# EAGLE board EEZ PSU consolidated r5B8 (EAGLE 6.1), part 1 of 4
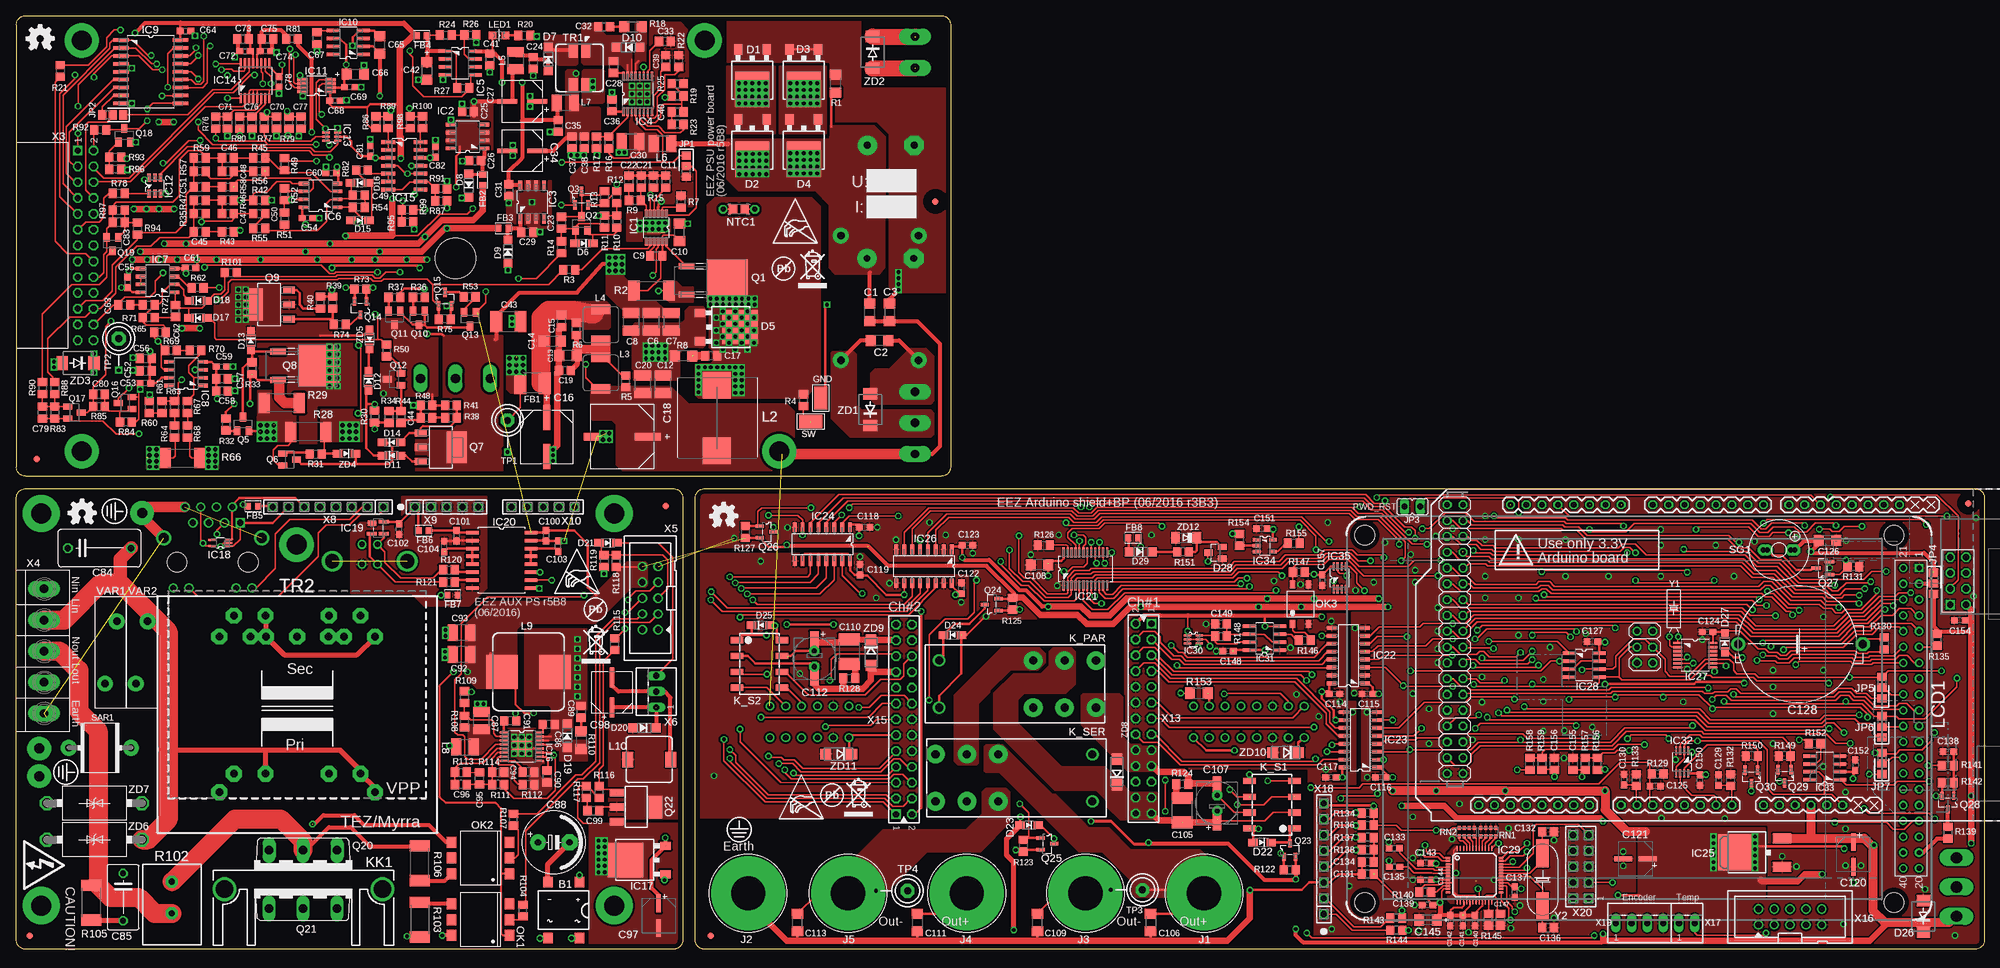
[diagram p12: board, top side]
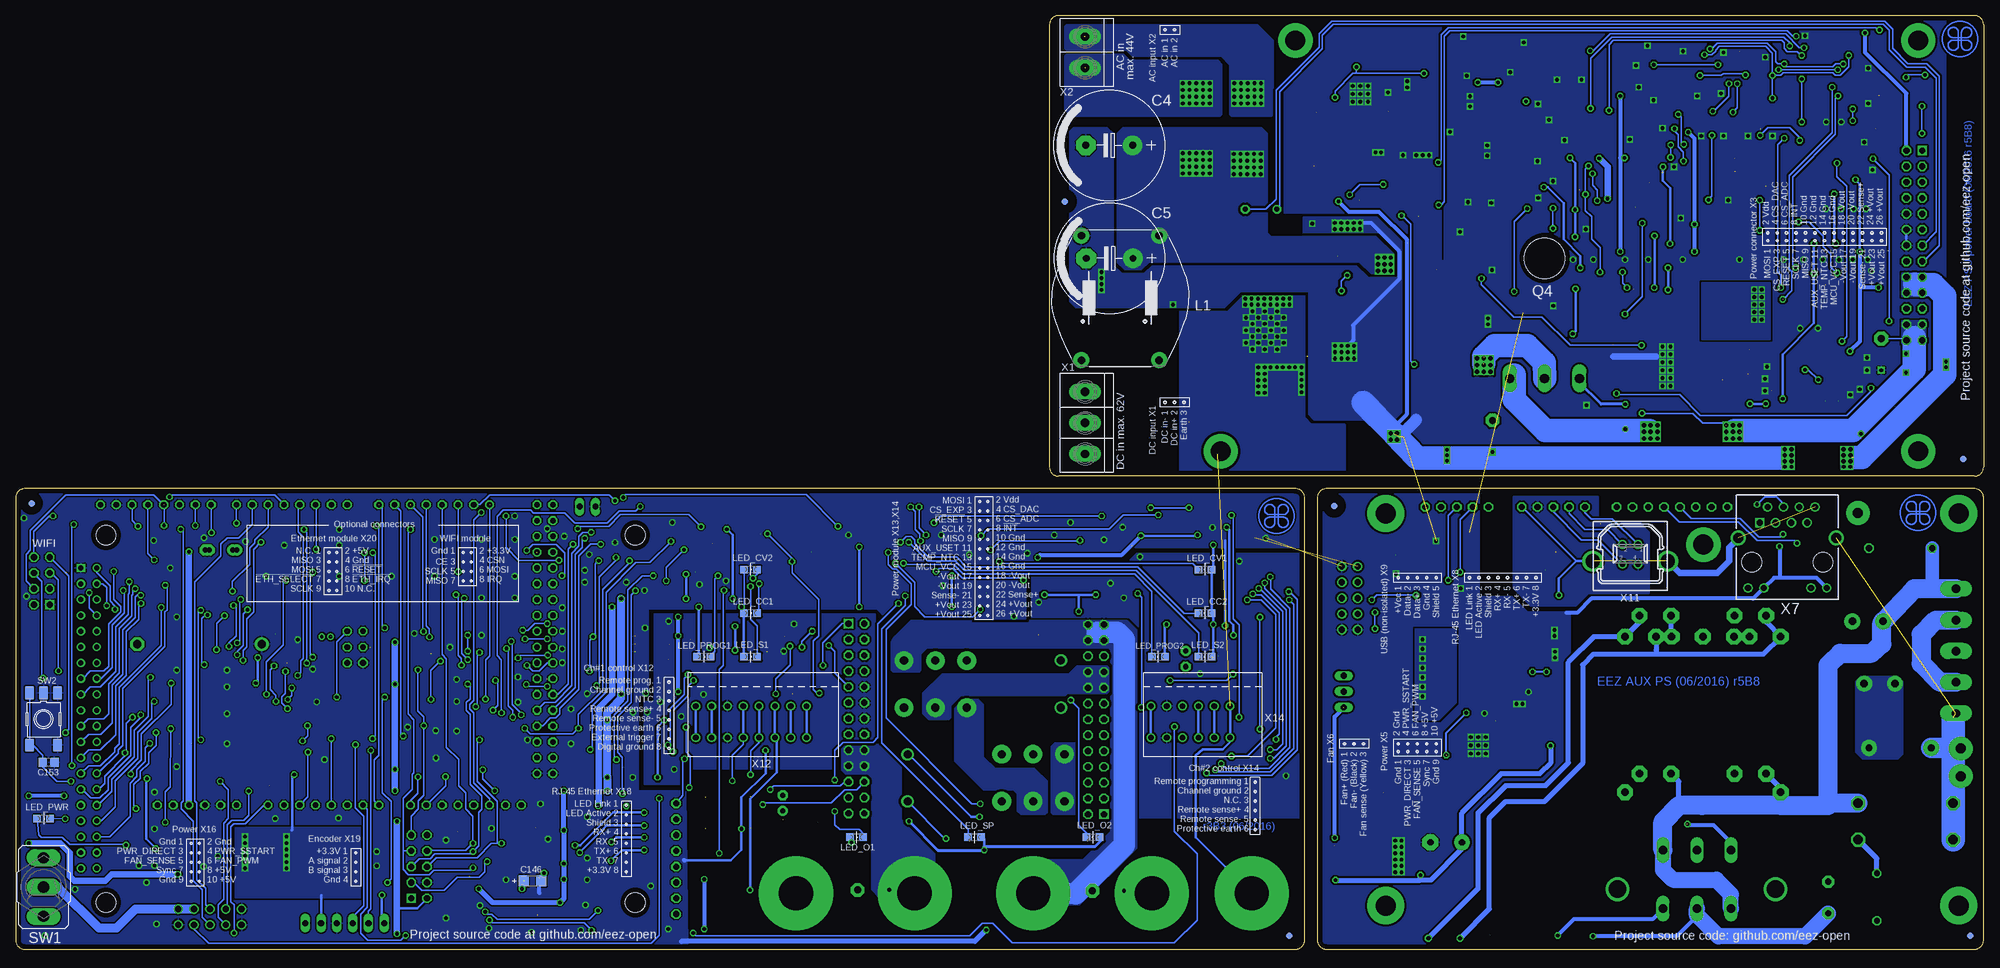
[diagram p13: board, bottom side, seen from below]

Size 316 x 150 mm. Coordinates in mm from the lower left corner, seen from the top.
Outline: 1.5,76 148.5,76 arc90 150,77.5 150,148.5 arc90 148.5,150 1.5,150 arc90 0,148.5 0,77.5 arc90 1.5,76
Outline: 1.5,74 105.5,74 arc-90 107,72.5 107,1.5 arc-90 105.5,0 1.5,0 arc-90 0,1.5 0,72.5 arc-90 1.5,74
Outline: 110.5,74 314.5,74 arc-90 316,72.5 316,1.5 arc-90 314.5,0 110.5,0 arc-90 109,1.5 109,72.5 arc-90 110.5,74
Copper layers (1+5*16): Top 0.035mm / dielectric 0.75mm / Route5 0.035mm / dielectric 0.75mm / Bottom 0.035mm
Design rules: minimum track width 10mil, minimum drill 0.5mm, track to track 8mil, track to pad 8mil, pad to pad 8mil, via to via 8mil, smd to smd 8mil, copper to edge 30mil, drill to drill 8mil, minimum pad ring 10mil, minimum via ring 8mil, stop-mask expansion 4mil, vias tented up to drill 25mil, thermal gap 10mil
Net classes: 0 default: width 0.254 mm, drill 0.584 mm, clearance 0.254 mm; 1 dgnd: width 0.254 mm, drill 0.584 mm, clearance 0.254 mm; 2 gnd: width 0.254 mm, drill 0.584 mm, clearance 0.254 mm

## Footprints (pad centres in the part's own frame; a part is rotated, then mirrored left to right if it is on the bottom)
DFS = smd 1.5 x 1.7: + -2.55,-4.5; - 2.55,-4.5; AC1 -2.55,4.5; AC2 2.55,4.5
C1206 = smd 1.6 x 1.8: 1 -1.4,0; 2 1.4,0
ECAP7.5/18 = drill 1.1 pad 3.14: + -3.75,0 | drill 1.1 pad 3.14 octagon: - 3.75,0
C1210 = smd 1.6 x 2.7: 1 -1.4,0; 2 1.4,0
C0805 = smd 1.3 x 1.5: 1 -0.95,0; 2 0.95,0
CAPAE830X1050N = smd 4.064 x 1.092: 1 -3.124,0; 2 3.124,0
PANASONIC_F = smd 4.166 x 1.194: 1 -4.064,0; 2 4.064,0
CAPAE660X610N = smd 3.251 x 0.762: 1 -2.413,0; 2 2.413,0
EC1206 = smd 1.6 x 1.8: + -1.4,0; - 1.4,0
C1812 = smd 1.9 x 3.4: 1 -1.95,0; 2 1.95,0
C0603 = smd 1.1 x 1: 1 -0.85,0; 2 0.85,0
C102-064X133 = drill 1.016 octagon: 1 -5.08,0; 2 5.08,0
C075-052X106 = drill 0.914 octagon: 1 -3.81,0; 2 3.81,0
ECAP5/10.5 = drill 1.016 pad 2.54: + -2.54,0 | drill 1.016 pad 2.54 octagon: - 2.54,0
PANASONIC_C = smd 2.87 x 0.762: 1 -1.981,0; 2 1.981,0
CAPAE660X610N_COMBO2 = smd 3.6 x 1.4: 1 -2.6,0; 2 2.5,0 | drill 0.813 pad 1.6: 1.1 -1.27,0 | drill 0.813 pad 1.6 octagon: 2.1 1.27,0
SG-R20MM = drill 1.3 pad 2.184 octagon: 1 10.389,0 | drill 1.3 pad 2.184: 2 -9.601,0
TO252@1 = smd 1.3 x 1.7: 1 -2.285,-5.49; 2 2.285,-5.49 | smd 5.5 x 5.7: 3 0,0.95
TO252 = smd 1.3 x 1.7: 1 -2.285,-5.49; 2 2.285,-5.49 | smd 5.5 x 5.7: 3 0,0.95
SOD323-W = smd 1.5 x 1.2: A 1.45,0; C -1.45,0
SOD123 = smd 1.4 x 1.4: A 1.9,0; C -1.9,0
DO214AA = smd 1.8 x 2.2: A 2.55,0; C -2.55,0
SOT23 = smd 1 x 1.4: 1 -0.95,-1.1; 2 0.95,-1.1; 3 0,1.1
L1812 = smd 1.9 x 3.4: 1 -1.95,0; 2 1.95,0
BEAD0603 = smd 1 x 1.1: P$1 -0.85,0; P$2 0.85,0
S1751-46R = smd 3.7 x 2.1: P$1 0,0
LTC_05-08-1666 = smd 1.27 x 0.457: 1 -2.235,1.63; 2 -2.235,0.98; 3 -2.235,0.33; 4 -2.235,-0.33; 5 -2.235,-0.98; 6 -2.235,-1.63; 7 2.235,-1.63; 8 2.235,-0.98; 9 2.235,-0.33; 10 2.235,0.33; 11 2.235,0.98; 12 2.235,1.63 | smd 1.753 x 2.946: TP 0,0
SOIC127P600X173-8N = smd 1.55 x 0.6: 1 -2.7,1.9; 2 -2.7,0.63; 3 -2.7,-0.64; 4 -2.7,-1.91; 5 2.7,-1.91; 6 2.7,-0.64; 7 2.7,0.63; 8 2.7,1.9
SOP65P640X110-16N = smd 1.422 x 0.356: 1 -2.845,2.286; 2 -2.845,1.626; 3 -2.845,0.965; 4 -2.845,0.33; 5 -2.845,-0.33; 6 -2.845,-0.965; 7 -2.845,-1.626; 8 -2.845,-2.286; 9 2.845,-2.286; 10 2.845,-1.626; 11 2.845,-0.965; 12 2.845,-0.33; 13 2.845,0.33; 14 2.845,0.965; 15 2.845,1.626; 16 2.845,2.286
SOIC127P600X175-8N = smd 1.981 x 0.559: 1 -2.464,1.905; 2 -2.464,0.635; 3 -2.464,-0.635; 4 -2.464,-1.905; 5 2.464,-1.905; 6 2.464,-0.635; 7 2.464,0.635; 8 2.464,1.905
SOIC127P1030X265-18N = smd 2.54 x 0.559: 1 -4.775,5.08; 2 -4.775,3.81; 3 -4.775,2.54; 4 -4.775,1.27; 5 -4.775,0; 6 -4.775,-1.27; 7 -4.775,-2.54; 8 -4.775,-3.81; 9 -4.775,-5.08; 10 4.775,-5.08; 11 4.775,-3.81; 12 4.775,-2.54; 13 4.775,-1.27; 14 4.775,0; 15 4.775,1.27; 16 4.775,2.54; 17 4.775,3.81; 18 4.775,5.08
DGK8-M = smd 1.727 x 0.483: 1 -2.235,0.965; 2 -2.235,0.33; 3 -2.235,-0.33; 4 -2.235,-0.965; 5 2.235,-0.965; 6 2.235,-0.33; 7 2.235,0.33; 8 2.235,0.965
SOT95P280X145-6N = smd 1.27 x 0.559: 1 -1.295,0.94; 2 -1.295,0; 3 -1.295,-0.94; 4 1.295,-0.94; 5 1.295,0; 6 1.295,0.94
SOT65P210X110-6N = smd 1.168 x 0.356: 1 -0.94,0.66; 2 -0.94,0; 3 -0.94,-0.66; 4 0.94,-0.66; 5 0.94,0; 6 0.94,0.66
PW(R-PDSO-G16) = smd 1.6 x 0.35: 1 -2.8,2.3; 2 -2.8,1.65; 3 -2.8,1; 4 -2.8,0.35; 5 -2.8,-0.3; 6 -2.8,-0.95; 7 -2.8,-1.6; 8 -2.8,-2.25; 9 2.8,-2.25; 10 2.8,-1.6; 11 2.8,-0.95; 12 2.8,-0.3; 13 2.8,0.35; 14 2.8,1; 15 2.8,1.65; 16 2.8,2.3
SOIC127P600X175-14N = smd 2.2 x 0.6: 1 -2.591,3.81; 2 -2.591,2.54; 3 -2.591,1.27; 4 -2.591,0; 5 -2.591,-1.27; 6 -2.591,-2.54; 7 -2.591,-3.81; 8 2.591,-3.81; 9 2.591,-2.54; 10 2.591,-1.27; 11 2.591,0; 12 2.591,1.27; 13 2.591,2.54; 14 2.591,3.81
SOP65P640X110-17N = smd 1.422 x 0.356: 1 -2.845,2.286; 2 -2.845,1.626; 3 -2.845,0.965; 4 -2.845,0.33; 5 -2.845,-0.33; 6 -2.845,-0.965; 7 -2.845,-1.626; 8 -2.845,-2.286; 9 2.845,-2.286; 10 2.845,-1.626; 11 2.845,-0.965; 12 2.845,-0.33; 13 2.845,0.33; 14 2.845,0.965; 15 2.845,1.626; 16 2.845,2.286 | smd 2.997 x 2.997: TP 0,0
SOT50P280X60-5N = smd 1.118 x 0.254: 1 -1.372,0.508; 2 -1.372,0; 3 -1.372,-0.508 | smd 1.118 x 0.305: 4 1.372,-0.508; 5 1.372,0.508
SOP192P292X122-4N = smd 0.94 x 1.321: 1 -0.762,-1.016 | smd 0.559 x 1.575: 2 0.965,-1.016; 3 0.965,0.889; 4 -0.965,0.889
SOIC-16W = smd 1.981 x 0.559: 1 -4.699,4.445; 2 -4.699,3.175; 3 -4.699,1.905; 4 -4.699,0.635; 5 -4.699,-0.635; 6 -4.699,-1.905; 7 -4.699,-3.175; 8 -4.699,-4.445; 9 4.699,-4.445; 10 4.699,-3.175; 11 4.699,-1.905; 12 4.699,-0.635; 13 4.699,0.635; 14 4.699,1.905; 15 4.699,3.175; 16 4.699,4.445
SOP63P600X175-24N = smd 1.6 x 0.356: 1 -2.667,3.505; 2 -2.667,2.845; 3 -2.667,2.235; 4 -2.667,1.575; 5 -2.667,0.965; 6 -2.667,0.305; 7 -2.667,-0.305; 8 -2.667,-0.965; 9 -2.667,-1.575; 10 -2.667,-2.235; 11 -2.667,-2.845; 12 -2.667,-3.505; 13 2.667,-3.505; 14 2.667,-2.845; 15 2.667,-2.235; 16 2.667,-1.575; 17 2.667,-0.965; 18 2.667,-0.305; 19 2.667,0.305; 20 2.667,0.965; 21 2.667,1.575; 22 2.667,2.235; 23 2.667,2.845; 24 2.667,3.505
SOIC-16 = smd 1.549 x 0.61: 1 -2.692,4.445; 2 -2.692,3.175; 3 -2.692,1.905; 4 -2.692,0.635; 5 -2.692,-0.635; 6 -2.692,-1.905; 7 -2.692,-3.175; 8 -2.692,-4.445; 9 2.692,-4.445; 10 2.692,-3.175; 11 2.692,-1.905; 12 2.692,-0.635; 13 2.692,0.635; 14 2.692,1.905; 15 2.692,3.175; 16 2.692,4.445
DPACK = smd 1.6 x 3: 1 -2.28,-4.8; 3 2.28,-4.8 | smd 5.8 x 6.2: 4 0,2.38
SOP65P640X120-14N = smd 1.473 x 0.356: 1 -2.819,1.956; 2 -2.819,1.295; 3 -2.819,0.66; 4 -2.819,0; 5 -2.819,-0.66; 6 -2.819,-1.295; 7 -2.819,-1.956; 8 2.819,-1.956; 9 2.819,-1.295; 10 2.819,-0.66; 11 2.819,0; 12 2.819,0.66; 13 2.819,1.295; 14 2.819,1.956
TQFP48-7X7 = smd 0.85 x 0.32: 1 -4.275,2.75; 2 -4.275,2.25; 3 -4.275,1.75; 4 -4.275,1.25; 5 -4.275,0.75; 6 -4.275,0.25; 7 -4.275,-0.25; 8 -4.275,-0.75; 9 -4.275,-1.25; 10 -4.275,-1.75; 11 -4.275,-2.25; 12 -4.275,-2.75; 25 4.275,-2.75; 26 4.275,-2.25; 27 4.275,-1.75; 28 4.275,-1.25; 29 4.275,-0.75; 30 4.275,-0.25; 31 4.275,0.25; 32 4.275,0.75; 33 4.275,1.25; 34 4.275,1.75; 35 4.275,2.25; 36 4.275,2.75 | smd 0.32 x 0.85: 13 -2.75,-4.275; 14 -2.25,-4.275; 15 -1.75,-4.275; 16 -1.25,-4.275; 17 -0.75,-4.275; 18 -0.25,-4.275; 19 0.25,-4.275; 20 0.75,-4.275; 21 1.25,-4.275; 22 1.75,-4.275; 23 2.25,-4.275; 24 2.75,-4.275; 37 2.75,4.275; 38 2.25,4.275; 39 1.75,4.275; 40 1.25,4.275; 41 0.75,4.275; 42 0.25,4.275; 43 -0.25,4.275; 44 -0.75,4.275; 45 -1.25,4.275; 46 -1.75,4.275; 47 -2.25,4.275; 48 -2.75,4.275
SOP65P400X130-8N = smd 1.321 x 0.356: 1 -1.829,0.965; 2 -1.829,0.33; 3 -1.829,-0.33; 4 -1.829,-0.965; 5 1.829,-0.965; 6 1.829,-0.33; 7 1.829,0.33; 8 1.829,0.965
SOT95P280X145-5N = smd 1.27 x 0.559: 1 -1.295,0.94; 2 -1.295,0; 3 -1.295,-0.94; 4 1.295,-0.94; 5 1.295,0.94
BP_5_12 = drill 5.5 pad 11.9: P$1 0,0
A0R-JMP = smd 1.5 x 1.3: 1 0,1.7; 2 0,0; 3 0,-1.7
JP1 = drill 0.914 long: 1 0,-1.27; 2 0,1.27
RT-C/016A5_ROUND = drill 1.3 pad 3: 11A 8.83,3.78; 11B 8.83,-3.78; 12A 3.79,3.78; 12B 3.79,-3.78; 14A 13.87,3.78; 14B 13.87,-3.78 | drill 1.3: A1 -11.33,-3.78; A2 -11.33,3.78
G6K-2F = smd 1 x 2: 1 -3.81,-3.6; 2 -1.27,-3.6; 3 1.27,-3.6; 4 3.81,-3.6; 5 3.81,3.6; 6 1.27,3.6; 7 -1.27,3.6; 8 -3.81,3.6
SK145 = drill 2.8: 1 -12.7,0; 2 12.7,0
RN114 = drill 1.2 pad 2.54: 1 -10,6.25; 2 -10,-6.25; 3 10,-6.25; 4 10,6.25
WE-HCI_1350/1365 = smd 4.25 x 4.5: 1 -5.25,0; 2 5.27,0
IHLP-2020BZ-11 = smd 3.048 x 1.524: 1 0,2.515; 2 0,-2.515
L1210 = smd 1.6 x 2.7: 1 -1.4,0; 2 1.4,0
MSS1278 = smd 5.5 x 5: 1 0,4.25; 2 0,-4.25
DE0704 = smd 2.5 x 1.8: 1 0,3.45; 2 0,-3.45
LCD_TFT_320QVT_MIRROR = drill 0.8 square: 1 48.26,0 | drill 0.8: 2 45.72,0; 3 43.18,0; 4 40.64,0; 5 38.1,0; 6 35.56,0; 7 33.02,0; 8 30.48,0; 9 27.94,0; 10 25.4,0; 11 22.86,0; 12 20.32,0; 13 17.78,0; 14 15.24,0; 15 12.7,0; 16 10.16,0; 17 7.62,0; 18 5.08,0; 19 2.54,0; 20 0,0; 21 48.26,2.54; 22 45.72,2.54; 23 43.18,2.54; 24 40.64,2.54; 25 38.1,2.54; 26 35.56,2.54; 27 33.02,2.54; 28 30.48,2.54; 29 27.94,2.54; 30 25.4,2.54; 31 22.86,2.54; 32 20.32,2.54; 33 17.78,2.54; 34 15.24,2.54; 35 12.7,2.54; 36 10.16,2.54; 37 7.62,2.54; 38 5.08,2.54; 39 2.54,2.54; 40 0,2.54 | hole 3.2: -5.5,4; 53.5,4; -5.5,89; 53.5,89
LED_0805 = smd 1.2 x 1.2: A 0,-1.05; C 0,1.05
ARDUINO+ICSP_MIRROR = drill 0.9 octagon: 0 63.5,2.54; 1 60.96,2.54; 2 58.42,2.54; 3 55.88,2.54; 3.3V 35.56,50.8; 4 53.34,2.54; 5 50.8,2.54; 5V 38.1,50.8; 5V(1) 93.98,2.54; 5V(2) 96.52,2.54; 6 48.26,2.54; 7 45.72,2.54; 8 41.656,2.54; 9 39.116,2.54; 10 36.576,2.54; 11 34.036,2.54; 12 31.496,2.54; 13 28.956,2.54; 14 68.58,2.54; 15 71.12,2.54; 16 73.66,2.54; 17 76.2,2.54; 18 78.74,2.54; 19 81.28,2.54; 20 83.82,2.54; 21 86.36,2.54; 22 93.98,5.08; 23 96.52,5.08; 24 93.98,7.62; 25 96.52,7.62; 26 93.98,10.16; 27 96.52,10.16; 28 93.98,12.7; 29 96.52,12.7; 30 93.98,15.24; 31 96.52,15.24; 32 93.98,17.78; 33 96.52,17.78; 34 93.98,20.32; 35 96.52,20.32; 36 93.98,22.86; 37 96.52,22.86; 38 93.98,25.4; 39 96.52,25.4; 40 93.98,27.94; 41 96.52,27.94; 42 93.98,30.48; 43 96.52,30.48; 44 93.98,33.02; 45 96.52,33.02; 46 93.98,35.56; 47 96.52,35.56; 48 93.98,38.1; 49 96.52,38.1; 50 93.98,40.64; 51 96.52,40.64; 52 93.98,43.18; 53 96.52,43.18; A0 50.8,50.8; A1 53.34,50.8; A2 55.88,50.8; A3 58.42,50.8; A4 60.96,50.8; A5 63.5,50.8; A6 66.04,50.8; A7 68.58,50.8; A8 73.66,50.8; A9 76.2,50.8; A10 78.74,50.8; A11 81.28,50.8; A12 83.82,50.8; A13 86.36,50.8; A14 88.9,50.8; A15 91.44,50.8; AREF 23.876,2.54; GND 26.416,2.54; GND1 40.64,50.8; GND2 43.18,50.8; GND3 93.98,45.72; GND4 96.52,45.72; ICSP_+5V 66.04,22.86; ICSP_MISO 63.5,22.86; ICSP_MOSI 66.04,25.4; ICSP_RESET 63.5,27.94; ICSP_SCK 63.5,25.4; RESET 33.02,50.8; VIN 45.72,50.8 | drill 1.016 octagon: ICSP_GND 66.04,27.94
R_0204/5+0805 = smd 1.3 x 1.5: 1 -0.95,0; 2 0.95,0 | drill 0.813 octagon: 1.1 -2.54,0 | drill 0.8 pad 1.422 octagon: 2.1 2.54,0
DIL6-SMD = smd 1.78 x 1.52: 1 -2.54,-4.645; 2 0,-4.645; 3 2.54,-4.645; 4 2.54,4.645; 5 0,4.645; 6 -2.54,4.645
HCPL-181 = smd 0.889 x 1.27: 1 -1.27,-3.175; 2 1.27,-3.175; 3 1.27,3.175; 4 -1.27,3.175
TO229P990X239-3N = smd 0.94 x 2.489: 1 -2.286,-6.401; 3 2.286,-6.401 | smd 6.731 x 6.528: 2 0,0.152
SOT23-BEC = smd 1 x 1.4: B -0.95,-1.1; C 0,1.1; E 0.95,-1.1
SOT103P240X110-3N = smd 1.524 x 0.559: 1 -1.079,1.016; 2 -1.079,-1.016; 3 1.079,0
TO247BH-CLR = drill 1.499 long: D 0,-19.304; G -5.588,-19.304; S 5.588,-19.304 | hole 6.5: 0,0
SOT230P700X180-4N = smd 1.905 x 1.143: 1 -3.2,2.311; 2 -3.2,0; 3 -3.2,-2.311 | smd 3.175 x 5.08: 4 2.565,0
SOT95P237X112-3N = smd 1.321 x 0.559: 1 -1.092,0.94; 2 -1.092,-0.94; 3 1.092,0
TOP3S-1 = drill 1.397 long: A1 -5.461,-3.175; A2 0,-3.175; G 5.461,-3.175
SOT223 = smd 1.219 x 2.235: 1 -2.311,-3.099; 2 0,-3.099; 3 2.311,-3.099 | smd 3.6 x 2.2: 4 0,3.099
R1206 = smd 1.6 x 1.803: 1 -1.422,0; 2 1.422,0
R2512 = smd 1.8 x 3.2: 1 -2.8,0; 2 2.8,0
R0805 = smd 1.3 x 1.5: 1 -0.95,0; 2 0.95,0
R_0913 = drill 1.016 pad 1.93 octagon: 1 -3.556,0; 2 1.524,0
CAY16 = smd 0.5 x 0.65: 1 -1.2,-0.675; 2 -0.4,-0.675; 3 0.4,-0.675; 4 1.2,-0.675; 5 1.2,0.675; 6 0.4,0.675; 7 -0.4,0.675; 8 -1.2,0.675
SAR = drill 1.1 pad 2.54: P$1 0,0; P$2 10,0
BUZZER = drill 0.8 pad 1.778 octagon: + 1.905,0; +B 2.54,0 | drill 0.8 pad 1.778: - -1.905,0; -B -2.54,0
SHORT_NOHOLE = smd 0.5 x 0.25 bottom: P$1 0,0.117; P$2 0,-0.117
M9040P = drill 1.803 long: 1 0,4.699; 2 0,0; 3 0,-4.699
TACTM-6XN = smd 2.1 x 1.4: 1 -4.2,2.25; 2 4.2,2.25; 3 -4.2,-2.25; 4 4.2,-2.25; 5 -4.2,0
TP_1.1MM = drill 0.6 square: GND 5.08,0 | drill 1.1 pad 2.184 octagon: TIP 0,0
SRF0703 = smd 1.4 x 2.1: 1 1,2.7; 2 -1,2.7; 3 -1,-2.7; 4 1,-2.7
PCB_TRAFO6VA_7.5W = drill 1.2 pad 2.54 octagon: NC -12.5,0; P1.1V 9.525,10.16; P1.2V 9.525,5.08; P1_TEZ 12.5,12.5; P2.1V 9.525,-5.08; P2.2V 9.525,-10.16; P2_TEZ 12.5,-12.5; S1.1T -12.5,12.5; S1.1V -15.875,10.16; S1.2T -12.5,7.5; S1.2V -15.875,5.08; S1M -12.5,5; S2.1T -12.5,-7.5; S2.1V -15.875,-5.08; S2.2T -12.5,-12.5; S2.2V -15.875,-10.16; S2M -12.5,-5
FIDUCIAL_DUAL = smd 1.016 x 1.016 bottom: B 0,0 | smd 1.016 x 1.016: T 0,0
VARISTOR = drill 1.2 pad 2.54: P$1 -5,0.95; P$2 5,-0.95
MOD-NRF24L01_MIRROR = drill 1 pad 1.5 square: 1 0,0 | drill 1 pad 1.5 octagon: 2 2.54,0; 3 0,2.54; 4 2.54,2.54; 5 0,5.08; 6 2.54,5.08; 7 0,7.62; 8 2.54,7.62
TBLOCK5.0_3 = drill 1.35 pad 2.54 long: 1 0,0; 2 0,-5; 3 0,-10
TBLOCK5.0_2 = drill 1.35 pad 2.54 long: 1 0,0; 2 0,-5
SSW-113-02-T-D-RA = drill 1 pad 1.5 square: 1 30.48,2.54 | drill 1 pad 1.5 octagon: 2 30.48,0; 3 27.94,2.54; 4 27.94,0; 5 25.4,2.54; 6 25.4,0; 7 22.86,2.54; 8 22.86,0; 9 20.32,2.54; 10 20.32,0; 11 17.78,2.54; 12 17.78,0; 13 15.24,2.54; 14 15.24,0; 15 12.7,2.54; 16 12.7,0; 17 10.16,2.54; 18 10.16,0; 19 7.62,2.54; 20 7.62,0; 21 5.08,2.54; 22 5.08,0; 23 2.54,2.54; 24 2.54,0; 25 0,2.54; 26 0,0
TBLOCK5.0_5 = drill 1.35 pad 2.54 long: 1 0,0; 2 0,-5; 3 0,-10; 4 0,-15; 5 0,-20
IDC-10PIN = drill 1 pad 1.422: 1 -5.08,-1.27; 2 -5.08,1.27; 3 -2.54,-1.27; 4 -2.54,1.27; 5 0,-1.27; 6 0,1.27; 7 2.54,-1.27; 8 2.54,1.27; 9 5.08,-1.27; 10 5.08,1.27
22-23-2031 = drill 1 long: 1 -2.54,0; 2 0,0; 3 2.54,0
RJ45-VERT = drill 1 square: 1 4.445,-5.08 | drill 1: 2 3.175,-7.62; 3 1.905,-5.08; 4 0.635,-7.62; 5 -0.635,-5.08; 6 -1.905,-7.62; 7 -3.175,-5.08; 8 -4.445,-7.62; GA -3.785,5.38; GC -6.325,5.38; YA 6.325,5.38; YC 3.785,5.38 | drill 1.6: SH1 7.875,-2.62; SH2 -7.875,-2.62 | hole 3.2: -5.715,1.27; 5.715,1.27
SSW-108-02-S-S = drill 1 pad 1.5 octagon: 1 -8.89,0; 2 -6.35,0; 3 -3.81,0; 4 -1.27,0; 5 1.27,0; 6 3.81,0; 7 6.35,0; 8 8.89,0
SSW-105-02-S-S = drill 1 pad 1.5 octagon: 1 -5.08,0; 2 -2.54,0; 3 0,0; 4 2.54,0; 5 5.08,0
KUSBVX-BS1N = drill 0.9 pad 1.422: 1 1.25,2.7; 2 -1.25,2.7; 3 -1.25,-0.5; 4 1.25,-0.5 | drill 2.3 pad 2.7: M1 -6.02,0; M2 6.02,0
MC000006_MIRROR = drill 0.9: 1 0,0; 1.1 0,-5.08; 2 -2.54,0; 2.1 -2.54,-5.08; 3 -5.08,0; 3.1 -5.08,-5.08; 4 -7.62,0; 4.1 -7.62,-5.08; 5 -10.16,0; 5.1 -10.16,-5.08; 6 -12.7,0; 6.1 -12.7,-5.08; 7 -15.24,0; 7.1 -15.24,-5.08; 8 -17.78,0; 8.1 -17.78,-5.08
TSW-113-07-F-D = drill 1 pad 1.5 square: 1 30.48,0 | drill 1 pad 1.5 octagon: 2 30.48,2.54; 3 27.94,0; 4 27.94,2.54; 5 25.4,0; 6 25.4,2.54; 7 22.86,0; 8 22.86,2.54; 9 20.32,0; 10 20.32,2.54; 11 17.78,0; 12 17.78,2.54; 13 15.24,0; 14 15.24,2.54; 15 12.7,0; 16 12.7,2.54; 17 10.16,0; 18 10.16,2.54; 19 7.62,0; 20 7.62,2.54; 21 5.08,0; 22 5.08,2.54; 23 2.54,0; 24 2.54,2.54; 25 0,0; 26 0,2.54
MC000005_MIRROR = drill 0.9: 1 0,0; 1.1 0,-5.08; 2 -2.54,0; 2.1 -2.54,-5.08; 3 -5.08,0; 3.1 -5.08,-5.08; 4 -7.62,0; 4.1 -7.62,-5.08; 5 -10.16,0; 5.1 -10.16,-5.08; 6 -12.7,0; 6.1 -12.7,-5.08
22-23-2021 = drill 1 long: 1 -1.27,0; 2 1.27,0
22-23-2041 = drill 1 long: 1 -3.81,0; 2 -1.27,0; 3 1.27,0; 4 3.81,0
SSW-105-02-S-D = drill 1 pad 1.5 square: 1 -5.08,-1.27 | drill 1 pad 1.5 octagon: 2 -5.08,1.27; 3 -2.54,-1.27; 4 -2.54,1.27; 5 0,-1.27; 6 0,1.27; 7 2.54,-1.27; 8 2.54,1.27; 9 5.08,-1.27; 10 5.08,1.27
R26_XTAL = drill 0.5: 1 -0.7,0; 2 0.7,0
HC-49/4H = smd 4.5 x 2: 1 -4.25,0; 2 4.25,0
DO201-BIDIR = drill 1.499 octagon: A 7.62,0; C -7.62,0
DO214AC = smd 1.8 x 1.7: A 2.05,0; C -2.05,0
MINIMELF = smd 1.4 x 1.8: A 1.7,0; C -1.7,0

## Placement (x,y rotation side)
B1  DF01S  [DFS]  87.88,6.29 180 top
C1  100n  [C1206]  137.03,102.3 90 top
C2  100n  [C1206]  138.62,97.79 180 top
C3  100n  [C1206]  140.21,102.3 270 top
C4  2m2  [ECAP7.5/18]  140.4,129.16 180 bottom
C5  2m2  [ECAP7.5/18]  140.34,111 180 bottom
C6  4u7  [C1210]  101.92,100.77 270 top
C7  4u7  [C1210]  105.16,100.77 270 top
C8  4u7  [C1210]  98.68,100.77 270 top
C9  470n  [C0805]  102.74,111.38 0 top
C10  1u  [C1206]  106.49,115.19 90 top
C11  100n  [C0805]  104.27,123.32 270 top
C12  10u  [C1210]  103.82,90.74 90 top
C13  1u  [C1206]  88.58,95.38 180 top
C14  1u  [C1206]  86.04,97.73 0 top
C15  100n  [C0805]  87.5,100.9 270 top
C16  EEEFK1J470P  [CAPAE830X1050N]  85.15,82.3 270 top
C17  330p  [C0805]  111.57,95.31 180 top
C18  EEEFK1J101P  [PANASONIC_F]  97.28,82.36 180 top
C19  100n  [C0805]  88.07,92.96 0 top
C20  10u  [C1210]  100.58,90.74 90 top
C21  120p  [C0805]  100.33,123.32 90 top
C22  4n7  [C0805]  98.36,123.32 90 top
C23  470p  [C0805]  87.5,116.71 270 top
C24  2u2  [C0805]  82.99,142.37 270 top
C25  330n  [C0805]  72.52,134.56 0 top
C26  100n  [C0805]  73.66,126.68 0 top
C27  47u  [CAPAE660X610N]  81.22,136.21 180 top
C28  22n  [C0805]  95.89,141.73 270 top
C29  100n  [C0805]  82.04,115.19 0 top
C30  2u2/100V  [C1210]  98.62,129.73 180 top
C31  330n  [C0805]  79.06,121.92 270 top
C32  330p  [C0805]  94.36,148.21 0 top
C33  10n  [C0805]  104.14,145.86 0 top
C34  47u  [CAPAE660X610N]  81.22,128.27 180 top
C35  2u2  [C0805]  87,132.27 270 top
C36  100n  [C0805]  95.63,135.57 270 top
C37  2u2  [C0805]  89.22,129.6 270 top
C38  2u2  [C0805]  91.19,129.6 270 top
C39  3n3  [C0805]  104.27,142.68 270 top
C40  1n  [C0805]  106.17,134.49 180 top
C41  100n  [C0805]  76.01,142.94 270 top
C42  4u7  [EC1206]  65.91,141.1 270 top
C43  470n  [C1812]  78.99,100.84 0 top
C44  10n  [C0805]  65.85,85.41 180 top
C45  47p  [C0805]  29.46,115.25 0 top
C46  1n  [C0805]  33.97,127.13 0 top
C47  2n2  [C0805]  33.97,118.17 0 top
C48  2n2  [C0805]  33.97,124.97 180 top
C49  120p  [C0805]  54.99,121.16 0 top
C50  1n  [C0805]  38.99,118.17 0 top
C51  47p  [C0805]  29.46,122.48 0 top
C52  10n  [C0805]  20.76,92.93 0 top
C53  100n  [C0603]  20.7,90.93 180 top
C54  100n  [C0603]  46.74,117.47 180 top
C55  100n  [C0603]  17.84,107.12 270 top
C56  1u  [C0805]  20.78,94.92 0 top
C57  10n  [C0805]  33.02,91.63 180 top
C58  1u  [C0805]  33.02,89.68 180 top
C59  100n  [C0603]  32.96,93.6 0 top
C60  100n  [C0603]  50.55,124.71 0 top
C61  100n  [C0603]  27.94,109.47 180 top
C62  1n  [C0805]  25.53,102.55 90 top
C63  1n  [C0805]  17.34,103.5 0 top
C64  100n  [C0603]  27.18,147.51 0 top
C65  10u  [C1206]  58.36,145.29 90 top
C66  10u  [EC1206]  54.42,140.59 0 top
C67  1u  [C0805]  48.26,146.37 270 top
C68  100n  [C0603]  51.18,136.33 180 top
C69  100n  [C0603]  53.53,138.49 180 top
C70  3n3  [C0805]  41.78,132.78 90 top
C71  3n3  [C0805]  33.91,132.78 270 top
C72  100n  [C0603]  36.7,144.27 0 top
C73  1u  [C0805]  36.39,146.24 0 top
C74  100n  [C0603]  40.01,144.27 180 top
C75  1u  [C0805]  40.32,146.24 180 top
C76  3n3  [C0805]  37.85,132.78 90 top
C77  3n3  [C0805]  45.72,132.78 90 top
C78  100n  [C0603]  42.16,139.32 90 top
C79  10n  [C0805]  4.19,86.23 90 top
C80  2n2  [C0805]  13.27,89.15 180 top
C81  100n  [C0603]  56.83,128.27 270 top
C82  100n  [C0603]  67.31,128.08 270 top
C83  10n  [C0805]  16.45,116.78 180 top
C84  6n8 (X1)  [C102-064X133]  13.34,64.45 0 top
C85  47n/400V  [C075-052X106]  17.14,8.38 270 top
C86  22n  [C0805]  85.47,36.13 180 top
C87  4u7  [C1210]  74.68,36.77 90 top
C88  1mF/25V  [ECAP5/10.5]  86.3,17.18 0 top
C89  330p  [C0805]  90.68,38.16 270 top
C90  22n  [C0805]  85.22,27.75 270 top
C91  100n  [C0805]  79.31,36.7 180 top
C92  4u7  [C1210]  71.5,47.37 180 top
C93  4u7  [C1210]  71.5,50.86 180 top
C94  1n  [C0805]  82.23,28.45 180 top
C95  3n9  [C0805]  74.36,27.46 90 top
C96  180p  [C0805]  71.37,26.48 180 top
C97  10u  [PANASONIC_C]  103.12,5.4 270 top
C98  100u  [CAPAE660X610N]  95.63,41.27 90 top
C99  47n  [C0805]  92.65,22.29 0 top
C100  100n  [C0603]  85.03,66.42 270 top
C101  100n  [C0603]  70.68,66.42 270 top
C102  100n  [C0603]  61.47,67.5 90 top
C103  100n  [C0603]  87,64.77 90 top
C104  100n  [C0603]  68.71,64.71 90 top
C105  470n/100V  [C1812]  187.2,22.35 90 top
C106  10n  [C1206]  182.12,4.32 270 top
C107  UPW1J150MED  [CAPAE660X610N_COMBO2]  192.79,23.5 90 top
C108  10u  [C1206]  164.27,61.72 180 top
C109  10n  [C1206]  163.96,4.32 90 top
C110  470n/100V  [C1812]  133.73,47.82 270 top
C111  10n  [C1206]  144.65,4.32 270 top
C112  UPW1J150MED  [CAPAE660X610N_COMBO2]  128.14,46.67 270 top
C113  10n  [C1206]  125.41,4.32 90 top
C114  100n  [C0603]  211.65,41.02 0 top
C115  100n  [C0603]  216.92,41.02 180 top
C116  100n  [C0603]  219.07,27.62 180 top
C117  100n  [C0603]  211.07,27.62 180 top
C118  100n  [C0603]  136.21,67.82 0 top
C119  100n  [C0603]  135.45,60.96 90 top
C120  47u  [PANASONIC_C]  294.96,15.24 270 top
C121  10u  [PANASONIC_C]  259.97,14.54 180 top
C122  100n  [C0603]  151.76,57.98 90 top
C123  100n  [C0603]  152.72,64.9 0 top
C124  100n  [C0603]  271.53,50.99 0 top
C125  100n  [C0603]  263.14,26.23 180 top
C126  10u  [C1206]  290.83,65.66 180 top
C127  100n  [C0603]  253.05,49.4 180 top
C128  EECS5R5H105  [SG-R20MM]  286.07,49.02 0 top
C129  100n  [C0603]  273.3,27.18 270 top
C130  100n  [C0603]  258.13,27.24 270 top
C131  22n  [C0805]  216.98,12.06 180 top
C132  18p  [C0805]  245.94,18.86 0 top
C133  6n8  [C0603]  221.23,16.26 0 top
C134  10n  [C0805]  216.98,14.03 180 top
C135  6n8  [C0603]  221.3,13.27 0 top
C136  18p  [C0805]  245.94,3.49 0 top
C137  100n  [C0603]  240.6,9.21 90 top
C138  100n  [C0603]  310.2,31.75 0 top
C139  100n  [C0603]  226.57,7.11 180 top
C140  100n  [C0603]  234.19,4.64 270 top
C141  100n  [C0603]  232.22,4.64 270 top
C142  100n  [C0603]  230.25,4.64 270 top
C143  100n  [C0603]  226.31,13.84 180 top
C144  100n  [C0603]  226.31,11.18 180 top
C145  10u  [EC1206]  226.63,4.7 180 top
C146  4u7  [EC1206]  232.98,10.99 0 bottom
C147  10n  [C0805]  238.32,4.76 90 top
C148  100n  [C0603]  194.56,47.88 180 top
C149  47n  [C0805]  193.42,52.26 0 top
C150  100n  [C0603]  270.32,27.18 90 top
C151  100n  [C0603]  199.96,67.56 180 top
C152  100n  [C0603]  295.27,29.59 270 top
C153  47n  [C0805]  310.71,30.04 180 bottom
C154  100n  [C0603]  312.04,52.83 180 top
C155  10n  [C0805]  249.94,29.78 270 top
C156  10n  [C0805]  246.95,29.78 90 top
C157  100n  [C0603]  209.68,59.31 270 top
D1  STPS15H100  [TO252@1]  118.17,139.06 180 top
D2  STPS15H100  [TO252@1]  118.17,127.83 180 top
D3  STPS15H100  [TO252@1]  126.43,139.06 180 top
D4  STPS15H100  [TO252@1]  126.43,127.83 180 top
D5  STPS15H100  [TO252]  115.25,99.95 270 top
D6  BAS316  [SOD323-W]  91.12,113.41 180 top
D7  DFLS1100-7  [SOD123]  85.41,143 270 top
D8  SKL16  [SOD123]  72.64,122.68 90 top
D9  SKL16  [SOD123]  78.93,112.08 270 top
D10  DFLS1100-7  [SOD123]  98.23,144.91 0 top
D11  BAS316  [SOD323-W]  60.26,79.31 0 top
D12  BAS316  [SOD323-W]  56.58,91.31 270 top
D13  BAS316  [SOD323-W]  37.66,97.79 270 top
D14  BAS316  [SOD323-W]  60.26,81.47 0 top
D15  BAS316  [SOD323-W]  55.18,117.09 180 top
D16  BAS316  [SOD323-W]  55.12,123.13 0 top
D17  BAS316  [SOD323-W]  29.15,101.41 0 top
D18  BAS316  [SOD323-W]  29.21,104.2 0 top
D19  DFLS1100-7  [SOD123]  88.46,34.35 270 top
D20  SKL16  [SOD123]  100.84,35.56 180 top
D21  BAS316  [SOD323-W]  95,65.28 180 top
D22  BAS316  [SOD323-W]  200.03,17.17 180 top
D23  BAS316  [SOD323-W]  162.62,19.94 180 top
D24  BAS316  [SOD323-W]  150.3,50.48 0 top
D25  BAS316  [SOD323-W]  119.51,52.07 0 top
D26  SMBJ5.0A-TR  [DO214AA]  306.2,5.27 90 top
D27  BAS316  [SOD323-W]  274.32,49.21 270 top
D28  BAT54S  [SOT23]  192.53,63.69 90 top
D29  SKL16  [SOD123]  180.53,63.82 180 top
EEZ_SIGNATURE  SIGNATURESMALL  [SIGNATURE_5MM]  3.81,146.25 180 top
EEZ_SIGNATURE1  SIGNATURESMALL  [SIGNATURE_5MM]  10.54,70.11 180 top
EEZ_SIGNATURE2  SIGNATURESMALL  [SIGNATURE_5MM]  113.55,69.61 180 top
FB1  2743019447  [L1812]  82.87,90.93 180 top
FB2  60R@100MHz  [BEAD0603]  74.87,123.57 270 top
FB3  60R@100MHz  [BEAD0603]  78.23,115.82 180 top
FB4  60R@100MHz  [BEAD0603]  65.09,146.75 180 top
FB5  60R@100MHz  [BEAD0603]  37.97,71.18 0 top
FB6  60R@100MHz  [BEAD0603]  65.41,67.25 0 top
FB7  60R@100MHz  [BEAD0603]  70.04,56.9 0 top
FB8  60R@100MHz  [BEAD0603]  179.32,66.1 180 top
GND  S1751-46R  [S1751-46R]  129.16,88.58 90 top
IC1  LTC3864  [LTC_05-08-1666]  102.74,115.95 270 top
IC2  MC79L05  [SOIC127P600X173-8N]  72.45,130.56 180 top
IC3  MC78L05  [SOIC127P600X173-8N]  82.8,120.02 90 top
IC4  LM5574  [SOP65P640X110-16N]  99.76,137.41 90 top
IC5  LP2951SO8  [SOIC127P600X175-8N]  71.25,142.37 0 top
IC6  TL072D  [SOIC127P600X173-8N]  48.83,121.09 180 top
IC7  TL072D  [SOIC127P600X173-8N]  22.67,107.44 180 top
IC8  OP27GSZ  [SOIC127P600X173-8N]  27.24,92.46 180 top
IC9  MCP23S08-E/SO  [SOIC127P1030X265-18N]  21.59,140.97 0 top
IC10  REF5025  [SOIC127P600X175-8N]  53.28,145.67 180 top
IC11  DAC8552  [DGK8-M]  48.2,138.75 180 top
IC12  ADG465SOT-23  [SOT95P280X145-6N]  22.23,122.68 90 top
IC13  TS5A9411DCKT  [SOT65P210X110-6N]  50.67,130.56 180 top
IC14  ADS1120  [PW(R-PDSO-G16)]  38.35,139.51 90 top
IC15  LP339D  [SOIC127P600X175-14N]  62.29,125.86 0 top
IC16  LM25575  [SOP65P640X110-17N]  81.15,32.58 0 top
IC17  MC7812  [TO252]  98.74,14.35 90 top
IC18  TPD4E002DRLR  [SOT50P280X60-5N]  32.77,65.28 180 top
IC19  TPD2E001DZDR  [SOP192P292X122-4N]  58.1,67.69 270 top
IC20  ADUM3160BRWZ  [SOIC-16W]  77.91,62.48 0 top
IC21  TLC5925IDBQR  [SOP63P600X175-24N]  171.64,61.09 90 top
IC22  Si8641EC-B-IS1  [SOIC-16]  213.87,47.18 180 top
IC23  SI8651EC-B-IS1  [SOIC-16]  215.77,33.66 180 top
IC24  SI8651EC-B-IS1  [SOIC-16]  129.41,65.09 270 top
IC25  LD1117ADT33TR  [DPACK]  278.7,15.56 90 top
IC26  Si8641EC-B-IS1  [SOIC-16]  145.73,61.53 270 top
IC27  PCA21125  [SOP65P640X120-14N]  269.56,47.24 0 top
IC28  AT25256B  [SOIC127P600X175-8N]  251.71,45.66 0 top
IC29  W5500  [TQFP48-7X7]  234.12,11.94 0 top
IC30  BC857BS  [SOT65P210X110-6N]  188.98,49.78 0 top
IC31  TLC555  [SOIC127P600X175-8N]  200.41,49.97 180 top
IC32  SN74LVC2G08DCTR  [SOP65P400X130-8N]  267.46,30.1 270 top
IC33  TPS3705-33D  [SOIC127P600X175-8N]  290.39,29.15 180 top
IC34  SN74LV1T34DBVR  [SOT95P280X145-5N]  200.47,64.83 0 top
IC35  SN74LVC2G02DCTR  [SOP65P400X130-8N]  212.47,59.69 90 top
J1  BS-244DSM-R  [BP_5_12]  190.7,9 0 top
J2  BS-244DSM-G  [BP_5_12]  117.5,9 0 top
J3  BS-244DSM-B  [BP_5_12]  171.65,9 0 top
J4  BS-244DSM-R  [BP_5_12]  152.6,9 0 top
J5  BS-244DSM-B  [BP_5_12]  133.55,9 0 top
JP1  0R-JUMPA  [A0R-JMP]  107.57,125.79 180 top
JP2  0R-JUMPA  [A0R-JMP]  15.49,134.05 90 top
JP3  826926-2  [JP1]  224.16,71.12 90 top
JP4  0R-JUMPA  [A0R-JMP]  307.85,58.8 0 top
JP5  0R-JUMPA  [A0R-JMP]  299.53,42.04 0 top
JP6  0R-JUMPA  [A0R-JMP]  299.53,35.75 0 top
JP7  0R-JUMPA  [A0R-JMP]  299.53,29.84 0 top
K_PAR  RT424005  [RT-C/016A5_ROUND]  159.48,42.61 0 top
K_S1  G6K-2F-5DC  [G6K-2F]  201.61,23.24 90 top
K_S2  G6K-2F-5DC  [G6K-2F]  119.32,45.85 270 top
K_SER  RT424005  [RT-C/016A5_ROUND]  161.45,27.56 180 top
KK1  SK 145/37,5  [SK145]  46.1,9.65 180 top
L1  RN114-4/02  [RN114]  138.62,104.65 90 bottom
L2  7443551331  [WE-HCI_1350/1365]  112.46,85.34 270 top
L3  IHLP2020CZER3R3M11  [IHLP-2020BZ-11]  93.85,92.58 180 top
L4  IHLP2020CZER3R3M11  [IHLP-2020BZ-11]  93.85,100.33 180 top
L5  2u2  [L1210]  80.14,142.75 270 top
L6  2u2  [L1210]  103.76,129.41 180 top
L7  2u2  [L1210]  88.14,135.95 180 top
L8  2u2  [L1210]  72.01,32.51 0 top
L9  100uH (MSS1260-104K)  [MSS1278]  82.23,44.58 270 top
L10  470u  [DE0704]  101.6,30.48 270 top
LCD1  TFT_320QVT  [LCD_TFT_320QVT_MIRROR]  305.5,13 90 top
LED1  HSMY-C170  [LED_0805]  77.47,146.81 270 top
LED_CC1  HSMH-C170  [LED_0805]  198,54 270 bottom
LED_CC2  HSMH-C170  [LED_0805]  125,54 90 bottom
LED_CV1  HSMY-C170  [LED_0805]  125,61 90 bottom
LED_CV2  HSMY-C170  [LED_0805]  198,61 270 bottom
LED_O1  HSMG-C170  [LED_0805]  181,18 270 bottom
LED_O2  HSMG-C170  [LED_0805]  143,18 90 bottom
LED_PROG1  HSMH-C170  [LED_0805]  205.5,47 270 bottom
LED_PROG2  HSMH-C170  [LED_0805]  132.5,47 90 bottom
LED_PWR  HSMR-C170  [LED_0805]  311.5,21 270 bottom
LED_S1  HSMY-C170  [LED_0805]  198,47 270 bottom
LED_S2  HSMY-C170  [LED_0805]  125,47 90 bottom
LED_SP  HSMH-C170  [LED_0805]  162,18 90 bottom
MCU  Arduino Due  [ARDUINO+ICSP_MIRROR]  326.25,73.95 180 top
NTC1  10K/Beta:3570K  [R_0204/5+0805]  116.01,118.87 0 top
OK1  MOC3052  [DIL6-SMD]  74.55,4.76 90 top
OK2  MOC3062  [DIL6-SMD]  74.55,14.67 90 top
OK3  HCPL-181  [HCPL-181]  206.18,55.44 0 top
Q1  SUD19P06-60  [TO229P990X239-3N]  113.98,107.44 270 top
Q2  MMBT5401  [SOT23-BEC]  90.74,116.59 0 top
Q3  2N7002  [SOT103P240X110-3N]  90.74,120.65 90 top
Q4  IRFP250N  [TO247BH-CLR]  70.5,111 0 top
Q5  BC857C  [SOT23-BEC]  36.39,84.39 0 top
Q6  BC846C  [SOT23-BEC]  43.88,78.68 270 top
Q7  BCP56-16.115  [SOT230P700X180-4N]  68.14,80.64 0 top
Q8  IRFR5410  [TO229P990X239-3N]  48.39,93.75 270 top
Q9  BCP56-16.115  [SOT230P700X180-4N]  40.58,103.57 180 top
Q10  MMBT5401  [SOT23-BEC]  64.64,101.41 180 top
Q11  MMBT5401  [SOT23-BEC]  60.71,101.41 180 top
Q12  MMBT5551  [SOT23-BEC]  60.64,91.57 90 top
Q13  MMBT5551  [SOT23-BEC]  72.83,101.22 180 top
Q14  BSS84P  [SOT95P237X112-3N]  55.24,103 270 top
Q15  2N7002  [SOT103P240X110-3N]  68.83,104.46 90 top
Q16  MMBT5551  [SOT23-BEC]  17.46,87.76 90 top
Q17  MMBT5401  [SOT23-BEC]  9.33,86.23 270 top
Q18  MMBT5551  [SOT23-BEC]  17.34,130.75 0 top
Q19  MMBT5551  [SOT23-BEC]  15.43,113.28 180 top
Q20  BTA26-600  [TOP3S-1]  46.04,12.76 180 top
Q21  BTA26-600  [TOP3S-1]  46.04,9.72 0 top
Q22  IRLL014N  [SOT223]  99.5,22.86 270 top
Q23  IRLML2246TRPBF  [SOT95P237X112-3N]  204.47,15.94 90 top
Q24  IRLML2246TRPBF  [SOT95P237X112-3N]  156.59,55.37 180 top
Q25  IRLML2246TRPBF  [SOT95P237X112-3N]  165.54,16.95 0 top
Q26  IRLML2246TRPBF  [SOT95P237X112-3N]  120.46,67.06 0 top
Q27  2N7002  [SOT103P240X110-3N]  290.07,61.21 180 top
Q28  IRLML2246TRPBF  [SOT95P237X112-3N]  310.13,23.56 270 top
Q29  2N7002  [SOT103P240X110-3N]  283.91,27.81 270 top
Q30  2N7002  [SOT103P240X110-3N]  278.57,27.69 270 top
R1  12K  [R1206]  131.51,139.06 90 top
R2  R010/2W  [R2512]  101.98,105.79 0 top
R3  0R  [R0805]  88.77,109.16 180 top
R4  1K  [R0805]  126.36,88.2 270 top
R5  100R  [R0805]  97.85,91.25 90 top
R6  100R  [R0805]  89.92,99.63 90 top
R7  47K  [R0805]  106.74,120.08 90 top
R8  10R  [R1206]  107.12,95.31 0 top
R9  10K  [R0805]  99.31,120.33 0 top
R10  10K  [R0805]  96.39,116.9 270 top
R11  100K  [R0805]  94.42,116.9 270 top
R12  324K  [R0805]  96.39,120.84 90 top
R13  0R  [R0805]  94.42,120.84 270 top
R14  100K  [R0805]  87.5,112.78 270 top
R15  4K32  [R0805]  102.3,123.32 90 top
R16  39K  [R0805]  95.12,129.6 270 top
R17  1K8  [R0805]  93.15,129.6 90 top
R18  10R  [R1206]  99,148.21 180 top
R19  30K  [R0805]  106.17,137.1 0 top
R20  390R  [R0805]  81.53,146.81 0 top
R21  0R  [R0805]  7.05,141.1 270 top
R22  20K  [R0805]  106.36,142.68 90 top
R23  51K  [R0805]  106.17,132.52 180 top
R24  12K  [R0805]  68.96,146.88 0 top
R25  4K7  [R0805]  106.17,139.06 0 top
R26  3K9  [R0805]  72.9,146.88 0 top
R27  10K  [R0805]  71.75,138.37 0 top
R28  R080/3W  [R2512]  46.86,83.12 180 top
R29  2R2/2W  [R2512]  42.61,87.76 180 top
R30  2K2  [R0805]  57.53,85.6 270 top
R31  1K  [R0805]  48.07,79.57 0 top
R32  2K2  [R0805]  33.66,84.33 270 top
R33  2K2  [R0805]  37.85,93.34 90 top
R34  16K  [R0805]  59.82,85.53 270 top
R35  2K  [R0805]  29.46,118.17 180 top
R36  220R  [R0805]  64.64,104.71 0 top
R37  220R  [R0805]  60.71,104.71 0 top
R38  470R  [R0805]  69.79,85.41 0 top
R39  1K  [R0805]  50.8,103.89 90 top
R40  220R  [R0805]  48.83,103.89 90 top
R41  100R  [R0805]  69.79,87.38 180 top
R42  7K5  [R0805]  38.99,120.33 180 top
R43  10K  [R0805]  33.97,115.25 0 top
R44  560R  [R0805]  61.79,85.53 90 top
R45  220R  [R0805]  38.99,127.13 0 top
R46  100K  [R0805]  33.97,120.33 180 top
R47  20K  [R0805]  29.46,120.33 180 top
R48  51K  [R0805]  65.85,87.38 0 top
R49  10K  [R0805]  43.05,126.11 270 top
R50  470R  [R0805]  59.44,96.2 270 top
R51  10K  [R0805]  43.05,117.36 270 top
R52  7K5  [R0805]  43.05,121.28 90 top
R53  1K8  [R0805]  72.77,104.84 0 top
R54  0R  [R0805]  54.99,119.19 180 top
R55  220R  [R0805]  38.99,115.82 0 top
R56  100K  [R0805]  38.99,124.97 180 top
R57  20K  [R0805]  29.46,124.97 180 top
R58  10K  [R0805]  33.97,122.48 0 top
R59  2K  [R0805]  29.46,127.13 0 top
R60  180R 0.1%  [R0805]  21.34,87.12 270 top
R61  3K9 0.1%  [R0805]  23.37,87.12 90 top
R62  2K2  [R0805]  29.09,106.28 180 top
R63  51R 0.1%  [R0805]  25.4,87.12 90 top
R64  51R 0.1%  [R0805]  25.4,83.19 90 top
R65  2K2  [R0805]  23.06,99.12 0 top
R66  R020/2W  [R2512]  26.67,78.93 0 top
R67  51R 0.1%  [R0805]  27.5,87.12 90 top
R68  51R 0.1%  [R0805]  27.5,83.19 90 top
R69  3K9 0.1%  [R0805]  24.83,96.2 180 top
R70  180R 0.1%  [R0805]  28.77,96.2 180 top
R71  11K  [R0805]  21.27,101.47 180 top
R72  10K  [R0805]  21.27,103.5 0 top
R73  100K  [R0805]  55.24,106.05 0 top
R74  10K  [R0805]  51.94,100.39 0 top
R75  100K  [R0805]  68.77,101.22 180 top
R76  220R  [R0805]  32,132.78 90 top
R77  220R  [R0805]  39.81,132.78 90 top
R78  1K  [R0805]  16.45,121.41 180 top
R79  220R  [R0805]  43.75,132.78 90 top
R80  220R  [R0805]  35.88,132.78 90 top
R81  10R  [R0805]  44.26,146.24 180 top
R82  10K  [R0805]  55.5,125.16 0 top
R83  330R  [R0805]  6.16,86.23 270 top
R84  47K  [R0805]  17.59,84.71 180 top
R85  47K  [R0805]  13.27,87.19 0 top
R86  5K1  [R0805]  57.72,132.84 270 top
R87  47K  [R0805]  68.2,120.21 0 top
R88  750R  [R0805]  6.16,90.17 270 top
R89  5K6  [R0805]  59.69,132.84 90 top
R90  3K3  [R0805]  4.19,90.17 270 top
R91  2K2  [R0805]  68.2,122.17 180 top
R92  10K  [R0805]  13.46,131.64 180 top
R93  10K  [R0805]  15.88,127.25 0 top
R94  750R  [R0805]  19.43,115.76 270 top
R95  10K  [R0805]  62.8,116.84 0 top
R96  47K  [R0805]  15.88,125.29 180 top
R97  330R  [R0805]  16.45,118.75 0 top
R98  5K1  [R0805]  63.25,132.84 270 top
R99  12K  [R0805]  62.8,118.81 180 top
R100  5K6  [R0805]  65.21,132.84 90 top
R101  10K  [R0805]  34.42,108.71 0 top
R102  15R/7W  [R_0913]  24.96,7.3 270 top
R103  330R/2W  [R2512]  64.77,4.76 270 top
R104  270R  [R0805]  81.34,6.22 90 top
R105  150R/2W  [R2512]  12,7.49 270 top
R106  330R/2W  [R2512]  64.77,13.84 90 top
R107  270R  [R0805]  79.82,20.83 90 top
R108  15K  [R0805]  71.95,36.58 270 top
R109  2K2  [R0805]  71.95,40.51 270 top
R110  10R  [R1206]  90.68,33.59 90 top
R111  5K6 1%  [R0805]  77.34,26.48 180 top
R112  18K  [R0805]  82.23,26.48 0 top
R113  20K  [R0805]  71.37,28.45 0 top
R114  1K8 1%  [R0805]  77.34,28.45 0 top
R115  100R  [R0805]  96.08,49.02 90 top
R116  47K  [R0805]  93.6,25.27 90 top
R117  1K  [R0805]  91.5,25.27 270 top
R118  5K6  [R0805]  96.33,62.36 90 top
R119  10K  [R0805]  94.36,62.36 270 top
R120  22R  [R0805]  69.47,60.96 0 top
R121  22R  [R0805]  69.47,58.99 0 top
R122  4K7  [R0805]  204.47,12.76 0 top
R123  4K7  [R0805]  161.67,16.65 270 top
R124  1R  [R0805]  187.2,26.54 180 top
R125  100K  [R0805]  159.96,55.5 90 top
R126  1K5  [R0805]  164.97,64.9 0 top
R127  4K7  [R0805]  117.03,67.06 270 top
R128  1R  [R0805]  133.73,43.56 0 top
R129  4K7  [R0805]  263.52,28.19 0 top
R130  180R  [R0805]  299.91,49.15 270 top
R131  100K  [R0805]  294.96,61.47 180 top
R132  4K7  [R0805]  275.27,27.18 90 top
R133  4K7  [R0805]  260.1,27.18 90 top
R134  49R9  [R0805]  216.98,21.91 180 top
R135  10K  [R0805]  308.42,49.72 90 top
R136  49R9  [R0805]  216.98,19.94 0 top
R137  49R9  [R0805]  216.98,17.97 180 top
R138  49R9  [R0805]  216.98,16 0 top
R139  10R  [R0805]  310.13,18.73 270 top
R140  12K4  [R0805]  226.19,9.21 0 top
R141  10K  [R0805]  310.13,29.53 0 top
R142  100K  [R0805]  310.13,26.8 180 top
R143  180R  [R0805]  221.55,5.02 180 top
R144  180R  [R0805]  221.55,3.05 180 top
R145  10K  [R0805]  236.35,4.76 90 top
R146  180R  [R0805]  206.88,49.66 0 top
R147  1K5  [R0805]  205.93,60.58 180 top
R148  1K5  [R0805]  193.42,50.29 0 top
R149  30K  [R0805]  283.91,31.05 180 top
R150  30K  [R0805]  278.64,31.05 180 top
R151  100R  [R0805]  187.32,63.82 180 top
R152  0R  [R0805]  288.73,33.02 180 top
R153  10K  [R1206]  189.87,41.15 180 top
R154  1K  [R0805]  196.41,65.79 90 top
R155  1K  [R0805]  205.1,65.21 180 top
R156  4K7  [R0805]  253.87,29.78 90 top
R157  10K  [R0805]  251.9,29.78 90 top
R158  4K7  [R0805]  243.01,29.78 90 top
R159  10K  [R0805]  244.98,29.78 90 top
RN1  4x10K  [CAY16]  236.35,18.86 0 top
RN2  4x10K  [CAY16]  232.85,18.86 0 top
SAR1  CG2-470L  [SAR]  18.41,32.36 180 top
SG1  LD-BZEN-0903  [BUZZER]  283.02,64.14 0 top
SH1  Pgnd to Pout- short  [SHORT_NOHOLE]  94.74,82.99 180 top
SH2  Sgnd to Pgnd short  [SHORT_NOHOLE]  94.68,82.8 270 top
SH3  [SHORT_NOHOLE]  231.9,10.35 180 top
SW  S1751-46R  [S1751-46R]  127.57,84.77 0 top
SW1  A101SYCQ04  [M9040P]  311.5,10 0 bottom
SW2  1301.9316  [TACTM-6XN]  311.5,37 270 bottom
TP1  [TP_1.1MM]  78.87,84.96 270 top
TP2  [TP_1.1MM]  16.45,98.11 270 top
TP3  [TP_1.1MM]  180.8,9.54 180 top
TP4  [TP_1.1MM]  143.1,9.4 180 top
TR1  SRF0703-821M  [SRF0703]  90.42,141.6 0 top
TR2  TEZ6/D230/15V  [PCB_TRAFO6VA_7.5W]  45.09,37.72 270 top
U$1  [RECYCLE_BIN1/8]  90.75,45.91 0 top
U$2  [RECYCLE_BIN1/8]  125.54,106.24 0 top
U$3  [PB_SMALL]  123.19,109.35 0 top
U$4  [ESD_SYMBOL]  121.51,113.45 0 top
U$5  [PB_SMALL]  92.97,54.61 0 top
U$6  [ESD_SYMBOL]  86.46,57.19 0 top
U$7  [ESD_SYMBOL]  122.46,20.93 0 top
U$8  [RECYCLE_BIN1/8]  132.91,21.34 0 top
U$9  [PB_SMALL]  130.94,24.77 0 top
U$11  FIDUCIAL_2  [FIDUCIAL_DUAL]  3.3,78.74 0 top
U$12  FIDUCIAL_2  [FIDUCIAL_DUAL]  147.57,120.14 0 top
U$13  FIDUCIAL_2  [FIDUCIAL_DUAL]  2.16,2.16 0 top
U$14  FIDUCIAL_2  [FIDUCIAL_DUAL]  104.27,71.25 0 top
U$15  FIDUCIAL_2  [FIDUCIAL_DUAL]  313.44,71.63 0 top
U$16  FIDUCIAL_2  [FIDUCIAL_DUAL]  111.51,2.16 0 top
VAR1  S20K250  [VARISTOR]  15.18,47.69 90 top
VAR2  S20K250  [VARISTOR]  20.13,47.69 270 top
WIFI  NRF24L01 module  [MOD-NRF24L01_MIRROR]  310.51,55.37 0 top
X1  282836-3  [TBLOCK5.0_3]  144.27,79.57 180 bottom
X2  282836-2  [TBLOCK5.0_2]  144.27,141.6 180 bottom
X3  SSW-113-02-T-D-RA  [SSW-113-02-T-D-RA]  12.4,97.83 90 top
X4  282836-5  [TBLOCK5.0_5]  4.46,57.9 0 top
X5  09185067324  [IDC-10PIN]  101.78,56.42 90 top
X6  22-23-2031  [22-23-2031]  102.74,41.4 90 top
X7  LMJ2138812S0LOT6C  [RJ45-VERT]  31.51,63.43 180 bottom
X8  826629-8  [SSW-108-02-S-S]  50.04,71.06 180 top
X9  826629-5  [SSW-105-02-S-S]  69.09,71.06 0 top
X10  826629-5  [SSW-105-02-S-S]  84.58,71.06 0 top
X11  2411-01  [KUSBVX-BS1N]  56.75,62.35 0 bottom
X12  MC000006  [MC000006_MIRROR]  189,34 180 top
X13  TSW-113-07-F-D  [TSW-113-07-F-D]  182.25,21.83 90 top
X14  MC000005  [MC000005_MIRROR]  121,34 180 top
X15  TSW-113-07-F-D  [TSW-113-07-F-D]  141.25,52.17 270 top
X16  09185067324  [IDC-10PIN]  284.8,5.21 0 top
X17  22-23-2021  [22-23-2021]  268.22,4.19 0 top
X18  826629-8  [SSW-108-02-S-S]  209.93,14.54 90 top
X19  22-23-2041  [22-23-2041]  260.6,4.19 0 top
X20  SSW-105-02-S-D  [SSW-105-02-S-D]  251.21,13.27 90 top
Y1  32,768kHz  [R26_XTAL]  266.13,50.23 0 top
Y2  25MHz  [HC-49/4H]  245.05,11.18 270 top
ZD1  n.c.  [DO214AA]  137.1,86.68 90 top
ZD2  n.c.  [DO214AA]  137.48,144.08 270 top
ZD3  See Note 3.2  [DO214AA]  9.91,94.17 180 top
ZD4  BZX384-C15.115  [SOD323-W]  53.02,79.63 180 top
ZD5  PDZ6.2B  [SOD323-W]  56.71,97.98 90 top
ZD6  1.5KE400CA  [DO201-BIDIR]  12.54,17.63 0 top
ZD7  1.5KE400CA  [DO201-BIDIR]  12.54,23.48 0 top
ZD8  P4SMAJ60A  [DO214AC]  176.72,28.51 90 top
ZD9  P4SMAJ60A  [DO214AC]  137.22,47.67 270 top
ZD10  SMAJ18A  [DO214AC]  203.77,31.62 180 top
ZD11  SMAJ18A  [DO214AC]  132.03,31.37 180 top
ZD12  4V3  [MINIMELF]  187.83,66.1 180 top

## Tracks (layer width: path | path; a pad name or v marks a point on that pad's centre or on a via)
1V2O
  Top 0.254: IC29.22 235.88,8.42 236.09,8.64 237.24,8.64 237.81,8.06 237.81,6.16 238.25,5.71 C147.2
12VDC  (via drill 0.6)  (2 unrouted)
  Top 0.61: C98.1 X6.1 D20.C | IC17.2 104.23,17.91 v104.2,17.91 | C97.1 103.12,8.64 101.98,9.78 101.98,14.35 104.27,16.64
  Bottom 0.61: v104.2,17.91 104.2,37.34 102.74,38.8
!ADC1_SELECT  (via drill 0.6)
  Top 0.254: v253.75,34.23 253.37,33.85 242.63,33.85 241.87,34.61 229.11,34.61 228.47,33.97 224.92,33.97 224.6,33.66 219.84,33.66 219.2,33.02 IC23.4
  Bottom 0.254: v253.75,34.23 254.13,34.61 254.13,70.41 MCU.15
!ADC2_SELECT  (via drill 0.6)
  Top 0.254: IC26.4 146.37,66.86 149.42,69.91 169.23,69.91 170.05,69.09 173.1,69.09 173.99,69.98 214,69.98 214.95,69.03 218.69,69.03 222.06,65.66 v222.06,65.09
  Bottom 0.254: MCU.48 232.25,35.88 231.39,35.88 230.12,37.15 229.3,37.15 228.6,37.85 228.6,38.73 225.55,41.78 225.55,63.18 223.65,65.09 v222.06,65.09
!BP_OE  (via drill 0.6)
  Top 0.254: v218.44,72.58 218.88,73.01 288.08,73.01 MCU.10 | IC21.21 170.07,64.95 168.85,66.17 168.85,66.86 169.54,67.56 173.86,67.56 174.75,68.45 183.45,68.45 v183.96,67.94
  Bottom 0.254: v218.44,72.58 218,73.03 189.04,73.03 v183.96,67.94
!BP_OUT0  (via drill 0.6)
  Top 0.254: IC21.5 170.68,56.76 169.86,55.94 165.04,55.94 162.5,58.48 161.35,58.48 158.05,61.78 v158.05,62.29
  Bottom 0.254: v158.05,62.29 157.73,61.98 127.03,61.98 LED_CV1.C
!BP_OUT1  (via drill 0.6)
  Top 0.254: IC21.6 171.34,56.02 172.75,54.61 175.26,54.61 177.93,57.28 201.87,57.28 v202.25,57.66 | Q23.1 203.53,15.16 203.26,15.43 v203.01,15.43
  Top 0.406: Q23.1 203.53,12.77 R122.1
  Bottom 0.254: v203.01,15.43 203.01,44.96 202.38,45.59 202.38,57.53 v202.25,57.66
!BP_OUT2  (via drill 0.6)
  Top 0.254: IC21.7 171.94,56.66 173.04,55.56 v174.24,55.56 | v184.47,22.16 v184.47,27.18
  Bottom 0.254: LED_O1.C 179.7,18.41 180.53,19.24 183.71,19.24 184.47,20 v184.47,22.16 | v184.47,27.18 184.47,31.94 183.13,33.27 178.31,33.27 177.55,34.04 177.55,52.26 v174.24,55.56
!BP_OUT3  (via drill 0.6)
  Top 0.254: IC21.8 172.61,57.33 v173.16,56.77
  Bottom 0.254: v173.16,56.77 173.16,55.24 176.91,51.5 176.91,33.15 163.05,19.29 LED_SP.C
!BP_OUT4  (via drill 0.6)
  Top 0.254: IC21.9 173.22,59.3 173.55,59.63 195.33,59.63 196.28,60.58 202.63,60.58 v203.2,60.01
  Bottom 0.254: 204.13,46.95 LED_PROG1.C 204.45,47.07 203.71,47.82 203.71,59.5 v203.2,60.01 203.33,59.88
!BP_OUT5  (via drill 0.6)
  Top 0.254: IC21.10 173.88,57.33 174.81,56.39 176.21,56.39 177.67,57.85 197.55,57.85 v197.99,58.29
  Bottom 0.254: LED_S1.C 196.95,51.98 197.99,53.02 v197.99,58.29
!BP_OUT6  (via drill 0.6)
  Top 0.254: IC21.11 174.49,57.54 175.01,57.02 176.02,57.02 177.42,58.42 196.28,58.42 v196.6,58.74
  Bottom 0.254: LED_CC1.C 196.7,54.06 196.66,54.1 196.66,58.67 v196.6,58.74
!BP_OUT7  (via drill 0.6)
  Top 0.254: IC21.12 175.15,58.94 175.2,58.99 195.52,58.99 196.22,59.69 197.55,59.69 v197.61,59.63
  Bottom 0.254: LED_CV2.C 196.7,60.54 v197.61,59.63
!BP_OUT8  (via drill 0.6)
  Top 0.254: 161.96,17.89 162.48,17.89 162.56,17.97 162.56,21.91 v161.1,23.37 | IC21.13 v175.9,63.75
  Top 0.406: Q25.1 161.96,17.89 R123.1
  Bottom 0.254: v161.1,23.37 162.43,23.37 176.21,37.15 176.21,51.37 172.21,55.37 172.21,58.67 174.62,61.09 175.13,61.09 175.9,61.85 v175.9,63.75
!BP_OUT9  (via drill 0.6)
  Top 0.254: R125.1 161.04,54.55 v161.1,54.61 | IC21.14 174.49,62.31 v174.75,62.04
  Top 0.406: Q24.1 159.84,54.43 R125.1
  Bottom 0.254: v174.75,62.04 171.64,58.93 171.64,55.05 169.99,53.4 162.31,53.4 v161.1,54.61
!BP_OUT10  (via drill 0.6)
  Top 0.254: IC21.15 173.88,65.35 v173.93,65.41
  Bottom 0.254: v173.93,65.41 173.86,65.41 172.97,66.29 172.15,66.29 171.64,65.79 171.64,65.22 169.42,62.99 164.91,62.99 163.32,61.4 135.83,61.4 128.37,53.95 126.1,53.95 LED_CC2.C
!BP_OUT12  (via drill 0.6)
  Top 0.254: IC21.17 172.61,65.39 v172.59,65.41
  Bottom 0.254: v172.59,65.41 169.54,62.36 165.1,62.36 163.58,60.83 136.08,60.83 126.05,50.8 LED_S2.C
!BP_OUT13  (via drill 0.6)  (1 unrouted)
  Top 0.254: v146.56,40.01 146.56,50.48 149.16,53.09 152.78,53.09 153.8,54.1 153.8,58.93 v154.18,59.31 | v168.21,60.71 168.91,60.71 169.61,61.4 171.39,61.4 171.96,61.98 IC21.18
  Bottom 0.254: LED_O2.C 143.8,18.39 145.29,19.88 145.29,38.73 v146.56,40.01 | v154.18,59.31 154.56,59.69 164.02,59.69 165.54,61.21 167.7,61.21 v168.21,60.71
!BP_OUT14  (via drill 0.6)
  Top 0.254: 119.43,68 Q26.1 119.11,68 119.06,67.94 119.06,70.29 119.7,70.93 v127.57,70.93 | v170.94,71.06 170.5,71.5 134.3,71.5 v133.73,70.93 | IC21.19 171.34,64.72 171.7,65.09 171.7,66.17 171.32,66.55 v169.8,66.55
  Top 0.406: Q26.1 117.04,68 R127.1
  Bottom 0.254: v133.73,70.93 v127.57,70.93 | v170.94,71.06 170.94,67.69 v169.8,66.55
!BP_OUT15  (via drill 0.6)
  Top 0.254: v308.04,20.95 v308.04,20.96 307.15,21.84 297.43,21.84 v296.67,22.61 | v293.43,34.8 291.85,36.39 290.7,36.39 290.07,35.75 271.46,35.75 269.75,37.47 238.51,37.47 v238,37.97 | v172.28,71.06 172.66,71.5 215.33,71.5 v215.71,71.12 | v170.69,65.6 170.69,63.77 IC21.20
  Bottom 0.254: LED_PWR.C v308.04,20.95 | v296.67,22.61 296.67,22.67 296.99,22.99 296.99,26.48 295.97,27.5 295.97,28.57 294.64,29.91 294.64,31.56 293.43,32.77 v293.43,34.8 | v238,37.97 238,46.48 238.7,47.18 238.7,69.53 237.68,70.55 233.3,70.55 232.85,70.1 227.84,70.1 226.25,68.52 220.98,68.52 219.07,70.42 216.41,70.42 v215.71,71.12 | v170.69,65.6 170.69,65.66 170.81,65.79 170.81,66.74 171.51,67.44 171.51,70.29 v172.28,71.06
!CH1_ADC  (via drill 0.6)  (1 unrouted)
  Top 0.254: v208.03,44.13 207.52,44.64 185.8,44.64 183.51,46.93 183.51,47.75 182.75,48.51 180.97,48.51 179.71,47.24 | IC23.13 211.52,33.02 v211.26,32.83
  Bottom 0.254: v208.03,44.13 208.66,43.5 208.66,40.96 210.88,38.73 210.88,33.21 v211.26,32.83
!CH1_DAC  (1 unrouted)
  Top 0.254: IC22.12 210.57,47.82 209.11,46.35 187.77,46.35 187.01,47.12 185.8,47.12 183.64,49.28 183.64,50.16 182.75,51.05 180.97,51.05 179.71,49.78
!CH1_EXPANDER  (1 unrouted)
  Top 0.254: 211.2,46.55 210.44,46.55 209.68,45.78 187.52,45.78 186.75,46.55 185.55,46.55 182.32,49.77 X13.3
!CH1_INT
  Top 0.254: IC23.11 211.77,35.56 210.88,36.45 210.88,38.16 205.55,43.5 185.29,43.5 182.82,45.97 181,45.97 X13.8
!CH1_RESET  (via drill 0.6)
  Top 0.254: v207.14,43.18 206.25,44.07 185.55,44.07 182.39,47.23 X13.5 | IC23.14 v210.44,31.75
  Bottom 0.254: v207.14,43.18 208.09,42.23 208.09,40.7 210.31,38.48 210.31,31.88 v210.44,31.75
!CH2_ADC  (via drill 0.6)
  Top 0.254: X15.6 143.57,26.8 142.3,28.07 140.84,28.07 140.14,27.37 124.4,27.37 123.38,28.38 v123.38,28.83 | v111.51,56.13 113.35,54.29 143,54.29 146.37,57.66 IC26.13
  Bottom 0.254: v123.38,28.83 123.06,28.51 114.55,28.51 110.81,32.26 110.81,55.44 v111.51,56.13
!CH2_DAC  (via drill 0.6)
  Top 0.254: IC24.12 128.78,60.26 127.44,58.93 115.51,58.93 v115.44,58.86 | X15.4 143.64,24.26 142.37,22.99 140.72,22.99 139.45,24.26 120.46,24.26 114.55,30.16 v114.55,30.67
  Bottom 0.254: v114.55,30.67 113.98,30.67 111.95,32.7 111.95,54.48 115.44,57.98 v115.44,58.86
!CH2_EXPANDER  (via drill 0.6)
  Top 0.254: IC24.13 130.05,59.69 128.4,58.04 116.46,58.04 v116.39,57.98 | X15.3 140.27,24.26 139.7,24.83 120.71,24.83 115.51,30.04 115.51,31.11 v114.55,32.07
  Bottom 0.254: v116.39,57.98 116.2,57.98 112.52,54.29 112.52,33.02 113.47,32.07 v114.55,32.07
!CH2_INT  (via drill 0.6)
  Top 0.254: IC24.11 127.51,60.26 127.06,59.82 v114.55,59.82 | v122.43,29.84 124.65,29.84 125.98,28.51 138.81,28.51 140.91,30.61 141.86,30.61 143.12,29.34 X15.8
  Bottom 0.254: v122.43,29.84 121.67,29.08 114.75,29.08 111.38,32.45 111.38,54.74 114.49,57.85 114.49,59.75 v114.55,59.82
!CH2_RESET  (via drill 0.6)
  Top 0.254: X15.5 122.74,26.8 116.2,33.34 v116.2,35.37 | v116.2,53.34 116.59,53.72 143.26,53.72 147.64,58.1 IC26.14
  Bottom 0.254: v116.2,35.37 v116.2,53.34
!CONVEND1  (via drill 0.6)  (1 unrouted)
  Top 0.254: IC23.6 221.93,35.56 226.06,39.69 232.6,39.69 233.49,40.58 240.16,40.58 v240.54,40.2
  Bottom 0.254: v240.54,40.2 240.54,46.48 239.9,47.12 239.9,71.44
!CONVEND2  (via drill 0.6)
  Top 0.254: IC24.6 127.51,68.52 132.02,73.03 216.66,73.03 218.06,71.63 219.33,71.63 v219.77,72.07
  Bottom 0.254: MCU.20 242.41,71.44 241.49,71.44 239.9,73.01 220.71,73.01 v219.77,72.07
!DAC1_SELECT  (via drill 0.6)  (2 unrouted)
  Top 0.254: v230.63,49.85 227.46,49.85 226.31,48.7 218.63,48.7 217.74,47.82 216.47,47.82 | v250.51,51.05 250.13,51.44 236.09,51.44 234.51,49.85 v234.19,49.85
  Bottom 0.254: v230.63,49.85 v234.19,49.85 | 252.6,71.44 250.63,69.47 250.63,51.18 v250.51,51.05
!DAC2_SELECT  (via drill 0.6)
  Top 0.254: IC24.5 128.78,68.52 132.78,72.52 216.41,72.52 217.81,71.12 219.65,71.12 222.88,67.88 223.96,67.88 224.6,67.25 v224.6,66.04
  Bottom 0.254: MCU.47 229.73,38.49 226.12,42.1 226.12,63.44 224.98,64.58 224.98,65.66 v224.6,66.04
!DP_DRIVE
  Top 0.406: R39.1 50.8,100.9 | 50.8,100.9 50.8,100.59 R74.1 | Q9.1 50.44,101.26 50.8,100.9
!EEPROM_SELECT  (via drill 0.6)  (1 unrouted)
  Top 0.254: MCU.49 229.78,35.85 231.08,37.15 234.31,37.15 v234.82,37.66 | v236.41,49.47 247.4,49.47 249.3,47.56
  Bottom 0.254: v236.41,49.47 236.28,49.34 236.28,39.37 234.82,37.91 v234.82,37.66
!ETH_IRQ  (via drill 0.6)  (1 unrouted)
  Top 0.254: v310.01,69.6 249.33,69.6 MCU.18 | IC29.36 238.59,14.69 239.52,15.62 241.17,15.62 v242.57,17.02
  Bottom 0.254: WIFI.8 313.06,67.12 310.58,69.6 v310.01,69.6 | X20.8 249.87,15.88 243.71,15.88 v242.57,17.02 242.57,21.4 243.71,22.54 243.71,25.15 244.86,26.29 244.86,30.48 246.82,32.45 246.82,46.67 247.52,47.37 247.52,71.37
!ETH_SELECT  (via drill 0.6)  (1 unrouted)
  Top 0.254: IC29.32 242.18,12.69 v242.57,13.08 | v252.6,67.44 252.98,67.06 258.44,67.06 259.78,68.39 278.45,68.39 279.91,66.93 281.18,66.93 282.13,67.88 285.5,67.88 286.32,67.06 287.46,67.06 288.86,68.45 291.72,68.45 v292.16,68.07